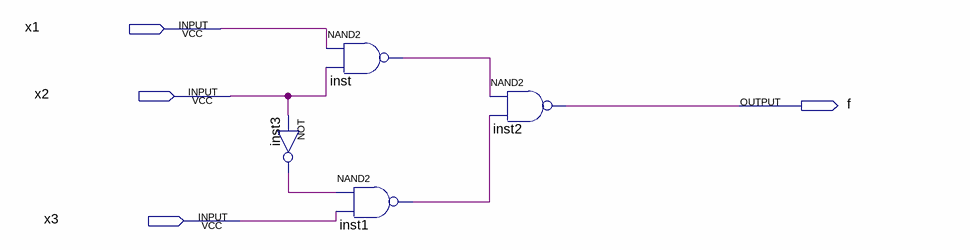
[diagram p0: schematic sheet]
// Quartus schematic test2.bdf as structural Verilog: 4 symbols, 4 pins
module test2 (
  input  x1,
  input  x2,
  input  x3,
  output f
);

  wire inst1_out, inst3_out, inst_out;

  nand inst (inst_out, x1, x2);
  not inst3 (inst3_out, x2);
  nand inst1 (inst1_out, inst3_out, x3);
  nand inst2 (f, inst_out, inst1_out);
endmodule
